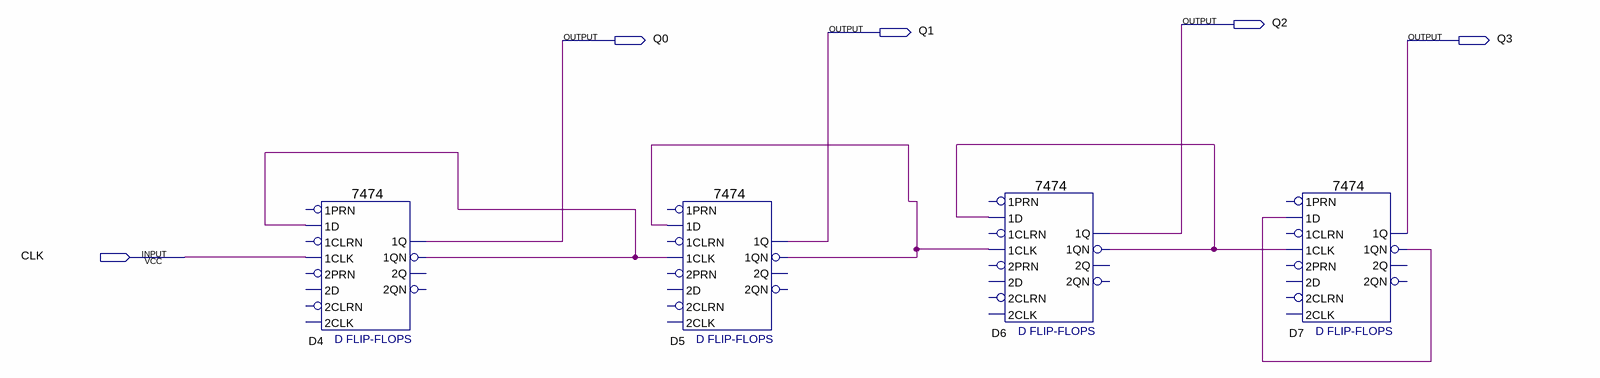
[diagram p0: schematic sheet]
// Quartus schematic fourBitCounterSync.bdf as structural Verilog: 4 symbols, 5 pins
module fourBitCounterSync (
  input  CLK,
  output Q2,
  output Q1,
  output Q0,
  output Q3
);

  wire D4_1qn, D5_1qn, D6_1qn, D7_1qn;

  \7474  D4 (
    .\1CLK (CLK), .\1D (D4_1qn), .\1QN (D4_1qn), .\1Q (Q0));  // open: 2D, 2PRN, 1PRN, 2CLK, 2CLRN, 1CLRN, 2Q, 2QN
  \7474  D5 (
    .\1CLK (D4_1qn), .\1D (D5_1qn), .\1QN (D5_1qn), .\1Q (Q1));  // open: 2D, 2PRN, 1PRN, 2CLK, 2CLRN, 1CLRN, 2Q, 2QN
  \7474  D6 (
    .\1CLK (D5_1qn), .\1D (D6_1qn), .\1QN (D6_1qn), .\1Q (Q2));  // open: 2D, 2PRN, 1PRN, 2CLK, 2CLRN, 1CLRN, 2Q, 2QN
  \7474  D7 (
    .\1CLK (D6_1qn), .\1D (D7_1qn), .\1QN (D7_1qn), .\1Q (Q3));  // open: 2D, 2PRN, 1PRN, 2CLK, 2CLRN, 1CLRN, 2Q, 2QN
endmodule
